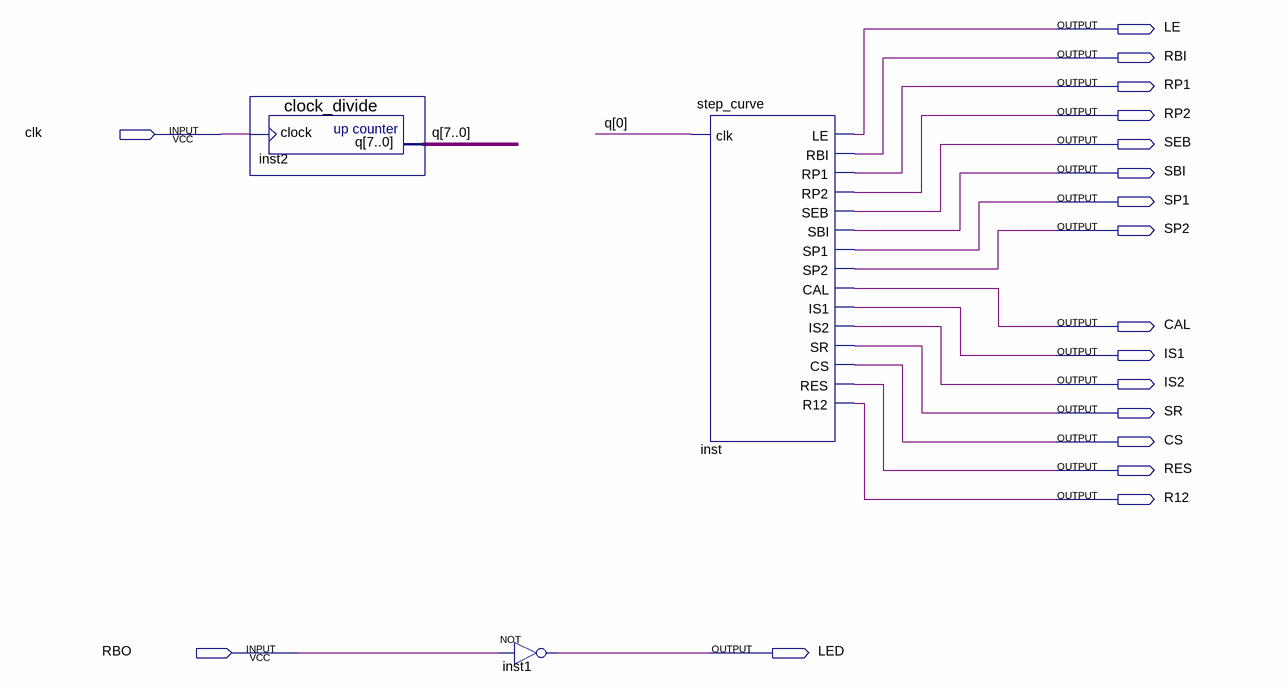
[diagram p0: schematic sheet]
// Quartus schematic step_curve_top.bdf as structural Verilog: 3 symbols, 18 pins
module step_curve_top (
  input  clk,
  input  RBO,
  output LE,
  output RBI,
  output RP1,
  output RP2,
  output SEB,
  output SBI,
  output SP1,
  output SP2,
  output CAL,
  output IS1,
  output IS2,
  output SR,
  output CS,
  output RES,
  output R12,
  output LED
);

  wire [7:0] q;

  clock_divide inst2 (.clock(clk), .q(q));
  not inst1 (LED, RBO);
  step_curve inst (
    .clk(q[0]), .LE(LE), .RBI(RBI), .RP1(RP1), .RP2(RP2), .SEB(SEB), .SBI(SBI), .SP1(SP1), .SP2(SP2),
    .CAL(CAL), .IS1(IS1), .IS2(IS2), .SR(SR), .CS(CS), .RES(RES), .R12(R12));
endmodule
